# Altium schematic sheet TUI.SchDoc
size A; SheetNumber: 7; SheetTotal: 12
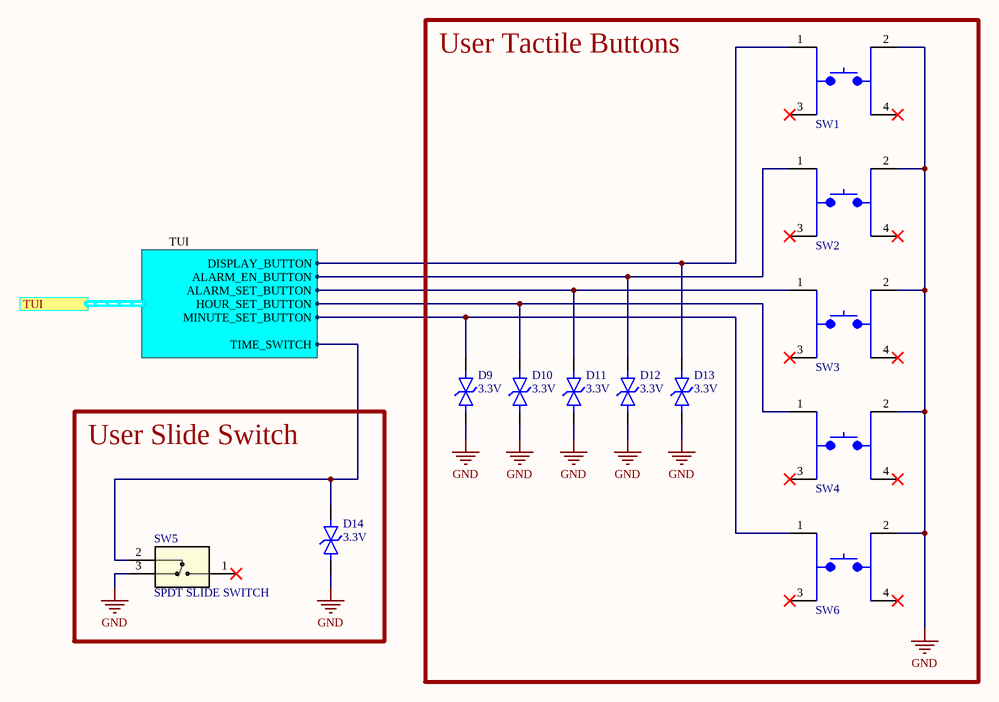
[diagram p0: TUI.SchDoc]

## Parts
D9  VRS: 3.3V  [0402-TVS]  (hidden comment: DESD3V3E1BL-7B)
D10  VRS: 3.3V  [0402-TVS]  (hidden comment: DESD3V3E1BL-7B)
D11  VRS: 3.3V  [0402-TVS]  (hidden comment: DESD3V3E1BL-7B)
D12  VRS: 3.3V  [0402-TVS]  (hidden comment: DESD3V3E1BL-7B)
D13  VRS: 3.3V  [0402-TVS]  (hidden comment: DESD3V3E1BL-7B)
D14  VRS: 3.3V  [0402-TVS]  (hidden comment: DESD3V3E1BL-7B)
SW1  SPDT PUSH BUTTON SWITCH  [430152080826]  (value not drawn)
SW2  SPDT PUSH BUTTON SWITCH  [430152080826]  (value not drawn)
SW3  SPDT PUSH BUTTON SWITCH  [430152080826]  (value not drawn)
SW4  SPDT PUSH BUTTON SWITCH  [430152080826]  (value not drawn)
SW5  SPDT SLIDE SWITCH  [JS102011SCQN]
SW6  SPDT PUSH BUTTON SWITCH  [430152080826]  (value not drawn)

## Blocks framed on the sheet
User Tactile Buttons: D9-D13 SW1-SW4 SW6
User Slide Switch: D14 SW5

## Ports
TUI (harness TUI, see Brain-PCB_MASTER[3B], MCU[1C])

## Harnesses
TUI: TIME_SWITCH, DISPLAY_BUTTON, ALARM_EN_BUTTON, MINUTE_SET_BUTTON, HOUR_SET_BUTTON, ALARM_SET_BUTTON

## Nets
GND: D9.2 D10.2 D11.2 D12.2 D13.2 D14.2 SW1.2 SW2.2 SW3.2 SW4.2 SW5.3 SW6.2
NetD9_1: D9.1 SW6.1 ; port TUI.MINUTE_SET_BUTTON
NetD10_1: D10.1 SW4.1 ; port TUI.HOUR_SET_BUTTON
NetD11_1: D11.1 SW3.1 ; port TUI.ALARM_SET_BUTTON
NetD12_1: D12.1 SW2.1 ; port TUI.ALARM_EN_BUTTON
NetD13_1: D13.1 SW1.1 ; port TUI.DISPLAY_BUTTON
NetD14_1: D14.1 SW5.2 ; port TUI.TIME_SWITCH

Not connected (* = marked no-connect by the designer): SW1 3* 4*; SW2 3* 4*; SW3 3* 4*; SW4 3* 4*; SW5 1*; SW6 3* 4*

## Library data of the parts
D9-D14 = TVS Diode 3.3V Bi: TVS DIODE 3.3VWM 7VC DFN1006-2; MFR: Diodes Incorporated; Type: SMD; VBR: 3.8V; VC: 7V; MFR PN: DESD3V3E1BL-7B
SW1-SW4 SW6 = SPDT PUSH BUTTON SWITCH: SWITCH TACTILE SPST-NO 0.05A 12V; MFR: Würth Elektronik; MFR PN: 430152095826; Type: SMD
SW5 = SPDT SLIDE SWITCH: MFR: C&K; MFR PN: JS102011SCQN; Type: SMD